# EAGLE board BE_PROJECT_PCB (EAGLE 9.5.2), part 1 of 2
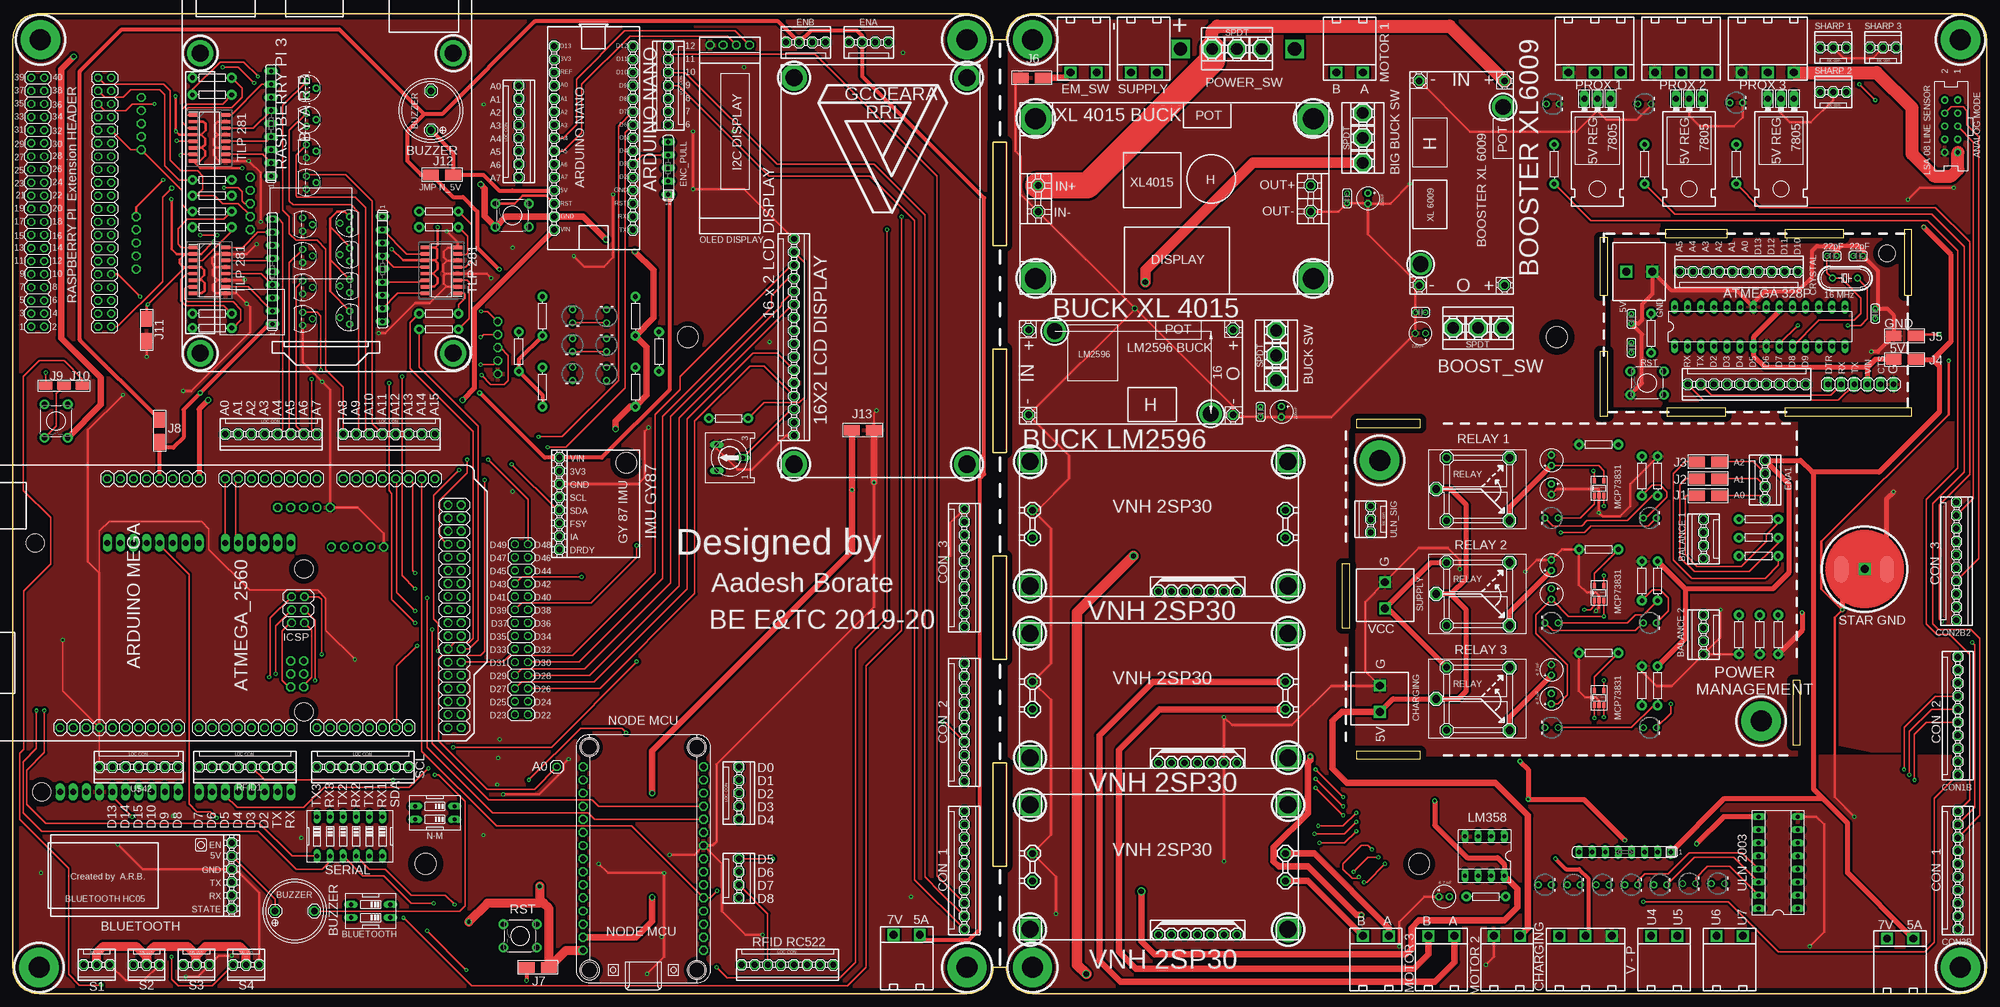
[diagram p3: board, top side]
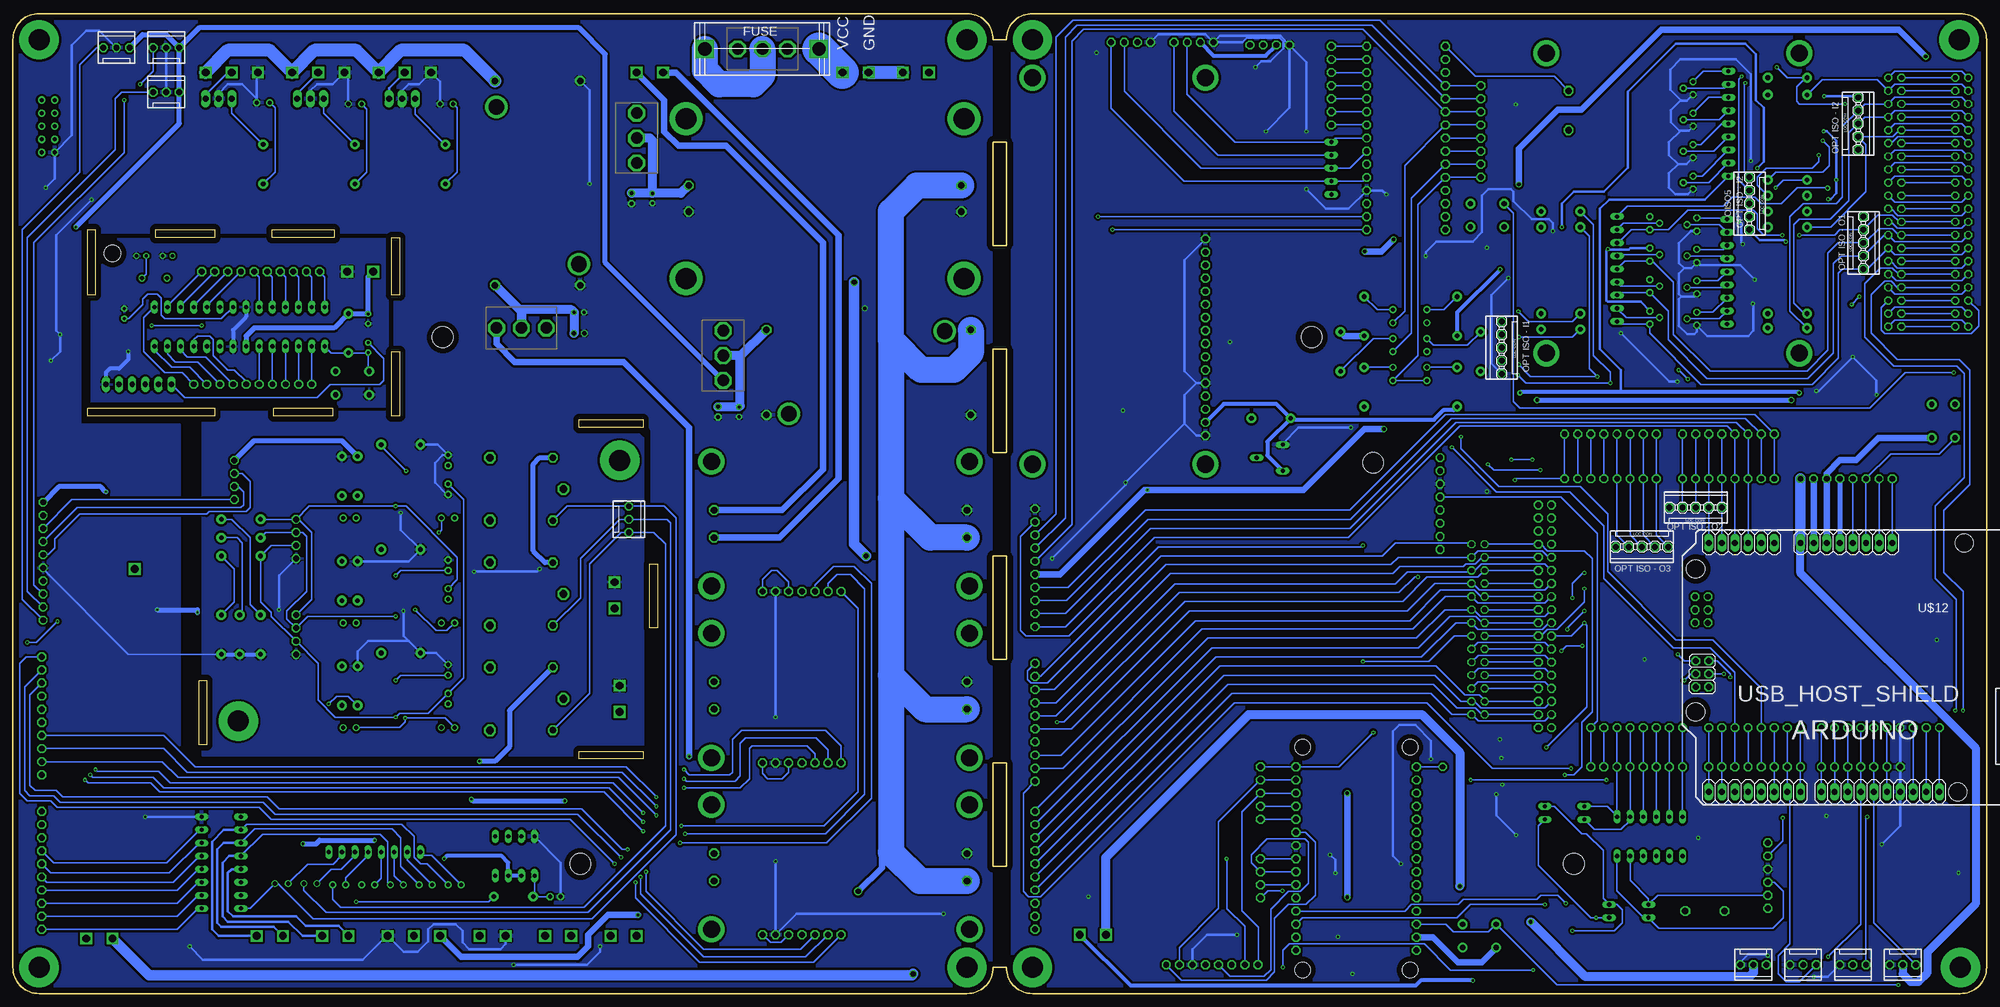
[diagram p4: board, bottom side, seen from below]

Size 382.52 x 189.99 mm. Coordinates in mm from the lower left corner, seen from the top.
Outline: 0,184.91 0,5.08 arc90 5.08,0 184.91,0 arc90 189.99,5.08 192.53,5.08 arc90 197.61,0 377.44,0 arc90 382.52,5.08 382.52,184.91 arc90 377.44,189.99 197.61,189.99 arc90 192.53,184.91 189.99,184.91 arc90 184.91,189.99 5.08,189.99 arc90 0,184.91
Outline: 189.99,165.1 189.99,145.03 192.53,145.03 192.53,165.1 189.99,165.1
Outline: 189.99,124.97 189.99,104.9 192.53,104.9 192.53,124.97 189.99,124.97
Outline: 189.99,84.84 189.99,64.77 192.53,64.77 192.53,84.84 189.99,84.84
Outline: 189.99,44.7 192.53,44.7 192.53,24.64 189.99,24.64 189.99,44.7
Outline: 307.59,146.56 307.59,135.38 309.12,135.38 309.12,146.56 307.59,146.56
Outline: 307.59,124.46 307.59,112.01 309.12,112.01 309.12,124.46 307.59,124.46
Outline: 320.55,113.54 320.55,112.01 331.98,112.01 331.98,113.54 320.55,113.54
Outline: 343.41,113.54 343.41,112.01 368.05,112.01 368.05,113.54 343.41,113.54
Outline: 366.52,148.08 366.52,135.38 368.05,135.38 368.05,148.08 366.52,148.08
Outline: 343.41,148.08 343.41,146.56 354.84,146.56 354.84,148.08 343.41,148.08
Outline: 320.29,146.56 332.23,146.56 332.23,148.08 320.29,148.08 320.29,146.56
Outline: 260.35,109.73 272.8,109.73 272.8,111.25 260.35,111.25 260.35,109.73
Outline: 257.56,83.31 257.56,70.87 259.08,70.87 259.08,83.31 257.56,83.31
Outline: 260.35,45.47 272.8,45.47 272.8,46.99 260.35,46.99 260.35,45.47
Outline: 344.93,60.71 344.93,48.26 346.46,48.26 346.46,60.71 344.93,60.71
Copper layers (1*16): Top 0.035mm / dielectric 1.5mm / Bottom 0.035mm
Design rules "default *": minimum track width 12mil, minimum drill 0.35mm, track to track 17mil, track to pad 12mil, pad to pad 12mil, via to via 12mil, smd to smd 12mil, copper to edge 40mil, drill to drill 40mil, minimum pad ring 10mil, minimum via ring 8mil, stop-mask expansion 12mil, vias tented up to drill 0mil, thermal gap 12mil
Net classes: 0 default: width 0.305 mm, drill 0.203 mm, clearance 0.203 mm; 1 V_SUPP: width 5.08 mm, drill 2.032 mm, clearance 0.406 mm; 2 GND: width 0.508 mm, drill 0.203 mm, clearance 0.305 mm; 5 5V: width 0.762 mm, drill 0.406 mm, clearance 0.305 mm; 6 7V: width 1.778 mm, drill 0.762 mm, clearance 0.305 mm
Holes 4.06 mm at 130.81,127.25 299.21,127.25 80.01,25.15 272.54,25.15
Holes 3.3 mm at 363.22,143.51
tRestrict: area 76.7,21.8 to 83.3,28.5; area 295.9,123.9 to 302.5,130.6

## Footprints (pad centres in the part's own frame; a part is rotated, then mirrored left to right if it is on the bottom)
SIL9 = drill 0.813 long: 1 -10.16,0; 2 -7.62,0; 3 -5.08,0; 4 -2.54,0; 5 0,0; 6 2.54,0; 7 5.08,0; 8 7.62,0; 9 10.16,0
AB_RIGHT_TER_BLK = drill 1.524 square: 1 -5.842,2.794; 2 -5.842,-2.286
AB_ARDUINO_MEGA = drill 1.13 octagon: 3V3 24.13,21.59; 5V 24.13,19.05; 5V1 -24.13,-36.83; 5V2 -24.13,-39.37; 5V3 -3.81,-9.017; - 24.13,29.21; A0 24.13,6.35; A1 24.13,3.81; A2 24.13,1.27; A3 24.13,-1.27; A4 24.13,-3.81; A5 24.13,-6.35; A6 24.13,-8.89; A7 24.13,-11.43; A8 24.13,-16.51; A9 24.13,-19.05; A10 24.13,-21.59; A11 24.13,-24.13; A12 24.13,-26.67; A13 24.13,-29.21; A14 24.13,-31.75; A15 24.13,-34.29; AREF -24.13,33.274; D2 -24.13,-1.27; D3 -24.13,1.27; D4 -24.13,3.81; D5 -24.13,6.35; D6 -24.13,8.89; D7 -24.13,11.43; D8 -24.13,15.494; D9 -24.13,18.034; D10 -24.13,20.574; D11 -24.13,23.114; D12 -24.13,25.654; D13 -24.13,28.194; D22 -21.59,-36.83; D23 -21.59,-39.37; D24 -19.05,-36.83; D25 -19.05,-39.37; D26 -16.51,-36.83; D27 -16.51,-39.37; D28 -13.97,-36.83; D29 -13.97,-39.37; D30 -11.43,-36.83; D31 -11.43,-39.37; D32 -8.89,-36.83; D33 -8.89,-39.37; D34 -6.35,-36.83; D35 -6.35,-39.37; D36 -3.81,-36.83; D37 -3.81,-39.37; D38 -1.27,-36.83; D39 -1.27,-39.37; D40 1.27,-36.83; D41 1.27,-39.37; D42 3.81,-36.83; D43 3.81,-39.37; D44 6.35,-36.83; D45 6.35,-39.37; D46 8.89,-36.83; D47 8.89,-39.37; D48 11.43,-36.83; D49 11.43,-39.37; D50 13.97,-36.83; D51 13.97,-39.37; D52 16.51,-36.83; D53 16.51,-39.37; GD3 19.05,-36.83; GD4 19.05,-39.37; GND 24.13,13.97; GND1 24.13,16.51; GND2 -24.13,30.734; GND5 1.245,-9.017; IOREF 24.13,26.67; MISO -3.81,-6.502; MOSI -1.295,-9.017; RST 24.13,24.13; RST1 1.245,-6.502; RX0 -24.13,-6.35; RX1 -24.13,-24.13; RX2 -24.13,-19.05; RX3 -24.13,-13.97; SCK -1.295,-6.502; SCL -24.13,-29.21; SCLU -24.13,38.354; SDA -24.13,-26.67; SDAU -24.13,35.814; TX0 -24.13,-3.81; TX1 -24.13,-21.59; TX2 -24.13,-16.51; TX3 -24.13,-11.43; VIN 24.13,11.43
AB_4PIN_LOC_CONNECTOR = drill 1.143 octagon: 1 0,-3.81; 2 0,-1.27; 3 0,1.27; 4 0,3.81
AB_SCREW_TERMINAL_5MM_2PIN = drill 1.524 square: 1 0,2.54; 2 0,-2.54
TO92 = drill 0.813 octagon: 1 1.27,0; 2 0,1.905; 3 -1.27,0
EDG-02 = drill 0.813 long: 1 -1.27,-3.81; 2 1.27,-3.81; 3 1.27,3.81; 4 -1.27,3.81
C020-035X018 = drill 0.61 pad 1.016 octagon: 1 -0.953,0; 2 0.953,0
AB_JOINT_GND = smd 2.54 x 5.08: 1 4.318,0; 2 -4.572,0 | drill 1.524 square: 3 0,0
LED_3MM-NS = drill 0.813: A -1.27,0; K 1.27,0
AXIAL-0.3 = drill 0.9 pad 1.88: P$1 -3.81,0; P$2 3.81,0
AB_10PIN_LOC_CONNECTOR = drill 1.143 octagon: 1 0,-12.7; 2 0,-10.16; 3 0,-7.62; 4 0,-5.08; 5 0,-2.54; 6 0,0; 7 0,2.54; 8 0,5.08; 9 0,7.62; 10 0,10.16
SIL5 = drill 0.813 long: 1 -5.08,0; 2 -2.54,0; 3 0,0; 4 2.54,0; 5 5.08,0
AB_FUSE_HOLDER = drill 2.54 square: IN 0,11.176; OUT 0,-10.922
RS3 = drill 0.813 long: A -2.54,2.54; E 2.54,2.54; S 0,-2.54
SOCKET-16 = drill 0.813 long: 1 -8.89,-3.81; 2 -6.35,-3.81; 3 -3.81,-3.81; 4 -1.27,-3.81; 5 1.27,-3.81; 6 3.81,-3.81; 7 6.35,-3.81; 8 8.89,-3.81; 9 8.89,3.81; 10 6.35,3.81; 11 3.81,3.81; 12 1.27,3.81; 13 -1.27,3.81; 14 -3.81,3.81; 15 -6.35,3.81; 16 -8.89,3.81
SOCKET-08 = drill 0.813 long: 1 -3.81,-3.81; 2 -1.27,-3.81; 3 1.27,-3.81; 4 3.81,-3.81; 5 3.81,3.81; 6 1.27,3.81; 7 -1.27,3.81; 8 -3.81,3.81
DIL28-3 = drill 0.813 long: 1 -16.51,-3.81; 2 -13.97,-3.81; 3 -11.43,-3.81; 4 -8.89,-3.81; 5 -6.35,-3.81; 6 -3.81,-3.81; 7 -1.27,-3.81; 8 1.27,-3.81; 9 3.81,-3.81; 10 6.35,-3.81; 11 8.89,-3.81; 12 11.43,-3.81; 13 13.97,-3.81; 14 16.51,-3.81; 15 16.51,3.81; 16 13.97,3.81; 17 11.43,3.81; 18 8.89,3.81; 19 6.35,3.81; 20 3.81,3.81; 21 1.27,3.81; 22 -1.27,3.81; 23 -3.81,3.81; 24 -6.35,3.81; 25 -8.89,3.81; 26 -11.43,3.81; 27 -13.97,3.81; 28 -16.51,3.81
SOIC127P700X210-16N = smd 1.8 x 0.65: 1 -3.15,4.445; 2 -3.15,3.175; 3 -3.15,1.905; 4 -3.15,0.635; 5 -3.15,-0.635; 6 -3.15,-1.905; 7 -3.15,-3.175; 8 -3.15,-4.445; 9 3.15,-4.445; 10 3.15,-3.175; 11 3.15,-1.905; 12 3.15,-0.635; 13 3.15,0.635; 14 3.15,1.905; 15 3.15,3.175; 16 3.15,4.445
1X01 = drill 1.016 octagon: 1 0,0
2X14 = drill 1.016 octagon: 1 -16.51,-1.27; 2 -16.51,1.27; 3 -13.97,-1.27; 4 -13.97,1.27; 5 -11.43,-1.27; 6 -11.43,1.27; 7 -8.89,-1.27; 8 -8.89,1.27; 9 -6.35,-1.27; 10 -6.35,1.27; 11 -3.81,-1.27; 12 -3.81,1.27; 13 -1.27,-1.27; 14 -1.27,1.27; 15 1.27,-1.27; 16 1.27,1.27; 17 3.81,-1.27; 18 3.81,1.27; 19 6.35,-1.27; 20 6.35,1.27; 21 8.89,-1.27; 22 8.89,1.27; 23 11.43,-1.27; 24 11.43,1.27; 25 13.97,-1.27; 26 13.97,1.27; 27 16.51,-1.27; 28 16.51,1.27
1X06 = drill 1.016 long: 1 -6.35,0; 2 -3.81,0; 3 -1.27,0; 4 1.27,0; 5 3.81,0; 6 6.35,0
S10V = drill 0.8 pad 1.4: 1 5.08,-1.27; 2 5.08,1.27; 3 2.54,-1.27; 4 2.54,1.27; 5 0,-1.27; 6 0,1.27; 7 -2.54,-1.27; 8 -2.54,1.27; 9 -5.08,-1.27; 10 -5.08,1.27
TACTILE_SWITCH_PTH_6.0MM = drill 1.016 pad 1.88: 1 -3.251,2.261; 2 3.251,2.261; 3 -3.251,-2.261; 4 3.251,-2.261
AB_JUMPER_ONE_WAY = smd 3.048 x 2.032: 1 -2.286,0; 2 2.032,0
AB_5PIN_LOC_CONNECTOR = drill 1.143 octagon: 1 -1.524,-5.08; 2 -1.524,-2.54; 3 -1.524,0; 4 -1.524,2.54; 5 -1.524,5.08
AB_RIGHT_TER_BLK_3PIN = drill 1.524 square: 1 -5.588,5.08; 2 -5.588,0; 3 -5.588,-5.08
HC49U-V = drill 0.813: 1 -2.413,0; 2 2.413,0
2X20 = drill 1.016 octagon: 1 -24.13,-1.27; 2 -24.13,1.27; 3 -21.59,-1.27; 4 -21.59,1.27; 5 -19.05,-1.27; 6 -19.05,1.27; 7 -16.51,-1.27; 8 -16.51,1.27; 9 -13.97,-1.27; 10 -13.97,1.27; 11 -11.43,-1.27; 12 -11.43,1.27; 13 -8.89,-1.27; 14 -8.89,1.27; 15 -6.35,-1.27; 16 -6.35,1.27; 17 -3.81,-1.27; 18 -3.81,1.27; 19 -1.27,-1.27; 20 -1.27,1.27; 21 1.27,-1.27; 22 1.27,1.27; 23 3.81,-1.27; 24 3.81,1.27; 25 6.35,-1.27; 26 6.35,1.27; 27 8.89,-1.27; 28 8.89,1.27; 29 11.43,-1.27; 30 11.43,1.27; 31 13.97,-1.27; 32 13.97,1.27; 33 16.51,-1.27; 34 16.51,1.27; 35 19.05,-1.27; 36 19.05,1.27; 37 21.59,-1.27; 38 21.59,1.27; 39 24.13,-1.27; 40 24.13,1.27
AB_ELECTROMAGNETIC_RELAY = drill 1.27 octagon: + -7.366,6.096; - -7.366,-6.096 | drill 1.524 octagon: COM -9.398,0; OUT_1 4.826,-6.096; OUT_2 4.826,6.096
AB_8PIN_LOC_CONNECTOR = drill 1.143 octagon: 1 -1.27,-8.89; 2 -1.27,-6.35; 3 -1.27,-3.81; 4 -1.27,-1.27; 5 -1.27,1.27; 6 -1.27,3.81; 7 -1.27,6.35; 8 -1.27,8.89
SIL8 = drill 0.813 long: 1 -8.89,0; 2 -6.35,0; 3 -3.81,0; 4 -1.27,0; 5 1.27,0; 6 3.81,0; 7 6.35,0; 8 8.89,0
AB_3PIN_LOC_CONNECTOR = drill 1.143 octagon: 1 -1.524,-2.54; 2 -1.524,0; 3 -1.524,2.54
EDG-06 = drill 0.813 long: 1 -6.35,-3.81; 2 -3.81,-3.81; 3 -1.27,-3.81; 4 1.27,-3.81; 5 3.81,-3.81; 6 6.35,-3.81; 7 6.35,3.81; 8 3.81,3.81; 9 1.27,3.81; 10 -1.27,3.81; 11 -3.81,3.81; 12 -6.35,3.81
AB_16X2_LCD_DISPLAY = drill 1.143 octagon: D0 0.508,7.874; D1 3.048,7.874; D2 5.588,7.874; D3 8.128,7.874; D4 10.668,7.874; D5 13.208,7.874; D6 15.748,7.874; D7 18.288,7.874; EN -2.032,7.874; GND -14.732,7.874; L+ 20.828,7.874; L- 23.368,7.874; R/W -4.572,7.874; RS -7.112,7.874; VCON -9.652,7.874; VIN -12.192,7.874 | drill 3.302 pad 5.08: P$1 -20.32,7.874; P$2 -20.32,-25.654; P$3 54.61,-25.654; P$4 54.61,7.874
AB_VNH2SP30_MODULE = drill 1.168 octagon: 5V 16.002,-13.208; CS 8.382,-13.208; EN 10.922,-13.208; GND 13.462,-13.208; INA 5.842,-13.208; INB 3.302,-13.208; PWM 0.762,-13.208 | drill 1.27 octagon: IN+ -23.622,-2.794; IN- -23.622,2.54; OA 25.4,2.54; OB 25.4,-2.794 | drill 3.302 pad 5.08: P$1 -24.13,11.938; P$2 -24.13,-12.192; P$3 25.908,-12.192; P$4 25.908,11.938
AB_ESP8266_BREAKOUT = drill 1.143 octagon: 3V3 -11.43,-4.572; 3V31 -11.43,18.288; 3V32 11.938,8.128; A0 11.938,-17.272; CLK 11.938,3.048; CMD 11.938,-2.032; D0 -11.43,-17.272; D1 -11.43,-14.732; D2 -11.43,-12.192; D3 -11.43,-9.652; D4 -11.43,-7.112; D5 -11.43,0.508; D6 -11.43,3.048; D7 -11.43,5.588; D8 -11.43,8.128; EN 11.938,10.668; GND 11.938,5.588; GND1 -11.43,15.748; GND2 -11.43,-2.032; GND3 11.938,15.748; RST 11.938,13.208; RSV 11.938,-12.192; RSV1 11.938,-14.732; RX -11.43,10.668; SD1 11.938,-4.572; SD2 11.938,-7.112; SD3 11.938,-9.652; SDD 11.938,0.508; TX -11.43,13.208; VIN 11.938,18.288 | hole 3.048: -10.16,-21.082; 10.668,-21.082; -10.16,22.098; 10.668,22.098
AB_RASPBERRY_PI_3 = drill 3.302 pad 5.08: P$1 -39.624,27.94; P$2 -39.624,-21.082; P$3 18.542,-21.082; P$4 18.542,27.94
AB_LM2596_BUCK_CONVERTER = drill 1.27 octagon: IN+ -19.304,6.35; IN- -19.304,-10.16; OUT+ 20.32,6.35; OUT- 20.32,-10.16 | drill 3.048 pad 4.318: P$1 -14.224,6.096; P$2 16.002,-9.906
AB_XL6009E1_BOOST_CONVERTER = drill 1.27 octagon: IN+ -19.304,6.35; IN- -19.304,-10.16; OUT+ 20.32,6.35; OUT- 20.32,-10.16 | drill 3.048 pad 4.318: P$1 -14.224,6.096; P$2 16.256,-9.906
AB_IMU_GY87 = drill 1.143 octagon: 3V3 -6.35,-7.112; DRDY 8.89,-7.112; FSY 3.81,-7.112; GND -3.81,-7.112; IA 6.35,-7.112; SCL -1.27,-7.112; SDA 1.27,-7.112; VIN -8.89,-7.112 | hole 4: -7.874,5.842
AB_BLUETOOTH_HC05 = drill 1.143 octagon: 5V -9.906,-4.064; EN -9.906,-6.604; GND -9.906,-1.524; RX -9.906,3.556; ST -9.906,6.096; TX -9.906,1.016
AB_USB_HOST_SHIELD_ARDUINO = drill 1.143 long: 3V3 1.27,-24.13; 5V1 3.81,-24.13; - -6.35,-24.13; A0 16.51,-24.13; A1 19.05,-24.13; A2 21.59,-24.13; A3 24.13,-24.13; A4 26.67,-24.13; A5 29.21,-24.13; AREF -10.414,24.13; D2 24.13,24.13; D3 21.59,24.13; D4 19.05,24.13; D5 16.51,24.13; D6 13.97,24.13; D7 11.43,24.13; D8 7.366,24.13; D9 4.826,24.13; D10 2.286,24.13; D11 -0.254,24.13; D12 -2.794,24.13; D13 -5.334,24.13; GND -7.874,24.13; GND2 8.89,-24.13; GND3 6.35,-24.13; RST1 -1.27,-24.13; RX0 29.21,24.13; SCL -15.494,24.13; SDA -12.954,24.13; TX0 26.67,24.13; VIN 11.43,-24.13; VREF -3.81,-24.13 | drill 1.168 octagon: 5V 31.75,3.81; GND1 31.75,-1.27; MISO 29.21,3.81; MOSI 31.75,1.27; RST 29.21,-1.27; SCK 29.21,1.27 | hole 3.56: 31.75,-19.05; 31.75,8.636; -19.05,24.13; -20.32,-24.13
AB_XL_4015_5A_BUCK = drill 1.27 octagon: IN+ -21.844,-3.302; IN- -21.844,-8.382; OUT+ 30.988,-3.302; OUT- 30.988,-8.382 | drill 4.064 pad 6.452: P$1 -22.352,9.652; P$2 -22.352,-21.336; P$3 31.496,-21.336; P$4 31.496,9.652
AB_SW = drill 2.25 octagon: IP 0,3.048; O1 -4.826,3.048; O2 4.826,3.048
AB_MCP_73831_LIPO_CHARGER = smd 0.599 x 1.1: PROG -0.864,1.346; STAT -0.864,-1.499; VBAT 1.016,-1.499; VDD 1.016,1.346; VSS 0.076,-1.499
AB_POL_CAP = drill 0.813 octagon: 1 -1.016,0; 2 1.016,0
AB_0.91INCH_I2C_DISPLAY = drill 1.143 octagon: GND -16.002,-3.302; SCL -16.002,1.778; SDA -16.002,4.318; VCC -16.002,-0.762
AB_BUZZER = drill 1.27 octagon: + -3.81,0; - 3.81,0
AB_JUMPER_TWO_WAY = smd 2.54 x 1.524: 1 -3.556,0; 2 3.556,0; C 0,0
AB_ARDUINO_NANO = drill 1.13 octagon: 3V3 -7.62,15.24; 5V -7.62,-10.16; A0 -7.62,10.16; A1 -7.62,7.62; A2 -7.62,5.08; A3 -7.62,2.54; A4 -7.62,0; A5 -7.62,-2.54; A6 -7.62,-5.08; A7 -7.62,-7.62; D2 7.62,-7.62; D3 7.62,-5.08; D4 7.62,-2.54; D5 7.62,0; D6 7.62,2.54; D7 7.62,5.08; D8 7.62,7.62; D9 7.62,10.16; D10 7.62,12.7; D11 7.62,15.24; D12 7.62,17.78; D13 -7.62,17.78; GND -7.62,-15.24; GND1 7.62,-10.16; REF -7.62,12.7; RST -7.62,-12.7; RST1 7.62,-12.7; RX 7.62,-15.24; TX 7.62,-17.78; VIN -7.62,-17.78
AB_7PIN_LOC_CONNECTOR = drill 1.143 octagon: 1 -1.524,-7.62; 2 -1.524,-5.08; 3 -1.524,-2.54; 4 -1.524,0; 5 -1.524,2.54; 6 -1.524,5.08; 7 -1.524,7.62
AB_7805_FLAT = drill 1.143 long: 1 -7.874,1.778; 2 -7.874,-0.762; 3 -7.874,-3.302
AB_PLATED_DRILL_160MIL = drill 4.064 pad 7.62: 1 0,0

## Placement (x,y rotation side)
10K  10k  [SIL9]  71.63,140.46 270 top
A  AB_RIGHT_TER_BLK  [AB_RIGHT_TER_BLK]  172.97,5.59 270 top
ATMEGA_2560  AB_ARDUINO_MEGA  [AB_ARDUINO_MEGA]  47.5,75.69 90 top
B  AB_RIGHT_TER_BLK  [AB_RIGHT_TER_BLK]  365.51,4.83 270 top
BALANCE  AB_4PIN_LOC_CONNECTOR  [AB_4PIN_LOC_CONNECTOR]  327.66,88.14 0 top
BALANCE1  AB_4PIN_LOC_CONNECTOR  [AB_4PIN_LOC_CONNECTOR]  327.66,69.6 0 top
BAT1  AB_SCREW_TERMINAL_5MM_2PIN  [AB_SCREW_TERMINAL_5MM_2PIN]  265.94,77.22 180 top
BAT6  AB_SCREW_TERMINAL_5MM_2PIN  [AB_SCREW_TERMINAL_5MM_2PIN]  315.21,139.95 90 top
BAT_SUPP  AB_RIGHT_TER_BLK  [AB_RIGHT_TER_BLK]  219.46,184.4 90 top
BC547  BC547  [TO92]  65.28,131.06 90 top
BLUETOOTH  [EDG-02]  69.34,16 90 top
C1  100nF  [C020-035X018]  241.81,112.78 90 top
C2  100nF  [C020-035X018]  313.69,125.22 270 top
C3  100nF  [C020-035X018]  272.8,132.08 0 top
C4  100nF  [C020-035X018]  258.57,154.18 90 top
C5  100nF  [C020-035X018]  313.69,130.81 270 top
C6  100nF  [C020-035X018]  357.63,143 180 top
C7  100nF  [C020-035X018]  352.55,143 180 top
C8  100nF  [C020-035X018]  360.93,131.83 90 top
C_GND  AB_JOINT_GND  [AB_JOINT_GND]  358.9,82.3 0 top
CEL1CC  [LED_3MM-NS]  298.2,92.2 180 top
CEL1CO  [LED_3MM-NS]  317.25,92.2 0 top
CEL1RC  470  [AXIAL-0.3]  318.77,100.33 270 top
CEL1RO  470  [AXIAL-0.3]  315.72,100.33 270 top
CEL2CC  [LED_3MM-NS]  317.25,71.88 0 top
CEL2CO  [LED_3MM-NS]  298.2,71.88 180 top
CEL2RC  470  [AXIAL-0.3]  315.72,80.01 270 top
CEL2RO  470  [AXIAL-0.3]  318.77,80.01 270 top
CEL2RO1  470  [AXIAL-0.3]  317.5,128.02 90 top
CEL3CC  [LED_3MM-NS]  317.25,51.56 0 top
CEL3CO  [LED_3MM-NS]  298.2,51.56 180 top
CEL3RC  470  [AXIAL-0.3]  315.72,59.69 270 top
CEL3RO  470  [AXIAL-0.3]  318.77,59.69 270 top
CON1A  AB_10PIN_LOC_CONNECTOR  [AB_10PIN_LOC_CONNECTOR]  184.4,51.31 180 top
CON1B  AB_10PIN_LOC_CONNECTOR  [AB_10PIN_LOC_CONNECTOR]  376.94,52.58 180 top
CON2A  AB_10PIN_LOC_CONNECTOR  [AB_10PIN_LOC_CONNECTOR]  184.4,22.61 180 top
CON2B  AB_10PIN_LOC_CONNECTOR  [AB_10PIN_LOC_CONNECTOR]  376.94,22.61 180 top
CON2B1  AB_10PIN_LOC_CONNECTOR  [AB_10PIN_LOC_CONNECTOR]  184.4,81.28 180 top
CON2B2  AB_10PIN_LOC_CONNECTOR  [AB_10PIN_LOC_CONNECTOR]  376.68,82.55 180 top
CS  AB_RIGHT_TER_BLK  [AB_RIGHT_TER_BLK]  289.31,5.33 270 top
D1  [LED_3MM-NS]  316.23,172.47 0 top
D2  [LED_3MM-NS]  334.01,172.72 0 top
D3  [LED_3MM-NS]  298.45,172.47 0 top
EM_SW  AB_RIGHT_TER_BLK  [AB_RIGHT_TER_BLK]  207.77,184.4 90 top
ENA  AB_4PIN_LOC_CONNECTOR  [AB_4PIN_LOC_CONNECTOR]  165.86,184.4 270 top
ENA1  AB_4PIN_LOC_CONNECTOR  [AB_4PIN_LOC_CONNECTOR]  339.6,99.57 180 top
ENB  AB_4PIN_LOC_CONNECTOR  [AB_4PIN_LOC_CONNECTOR]  153.67,184.4 270 top
ENC_PULL  [SIL5]  127,160.02 90 top
FUSE  AB_FUSE_HOLDER  [AB_FUSE_HOLDER]  237.49,183.13 270 bottom
G_P2  [RS3]  138.94,103.89 90 top
IC1  [SOCKET-16]  342.14,25.4 90 top
IC2  [SOCKET-08]  285.24,26.67 180 top
IC3  [DIL28-3]  338.58,129.29 0 top
IC8  TLP281-4(GB,J,F)  [SOIC127P700X210-16N]  83.06,140.21 180 top
IC9  TLP281-4(GB,J,F)  [SOIC127P700X210-16N]  38.1,140.21 0 top
IC10  TLP281-4(GB,J,F)  [SOIC127P700X210-16N]  38.1,165.86 0 top
IH1  [LED_3MM-NS]  108.46,120.14 270 top
IH2  [LED_3MM-NS]  108.46,125.73 270 top
IH3  [LED_3MM-NS]  108.46,131.32 270 top
IL1  [LED_3MM-NS]  115.06,120.14 90 top
IL2  [LED_3MM-NS]  115.06,125.73 90 top
IL3  [LED_3MM-NS]  115.06,131.32 90 top
IRH1  470  [AXIAL-0.3]  102.62,117.6 90 top
IRH2  470  [AXIAL-0.3]  98.04,124.46 90 top
IRH3  470  [AXIAL-0.3]  102.62,131.32 90 top
IRL1  470  [AXIAL-0.3]  120.65,117.6 90 top
IRL2  470  [AXIAL-0.3]  125.22,124.46 270 top
IRL3  470  [AXIAL-0.3]  120.65,131.32 90 top
JP1  [1X01]  105.41,43.94 0 top
JP2  [2X14]  98.55,70.61 90 top
JP3  [1X06]  358.14,118.11 0 top
L1  [LED_3MM-NS]  330.45,21.34 0 top
L2  [LED_3MM-NS]  324.87,21.34 0 top
L3  [LED_3MM-NS]  319.28,21.08 0 top
L4  [LED_3MM-NS]  313.69,21.08 0 top
L5  [LED_3MM-NS]  308.1,21.08 0 top
L6  [LED_3MM-NS]  302.51,21.08 0 top
L7  [LED_3MM-NS]  296.93,21.08 0 top
LSA_2  LSA1  [S10V]  375.67,168.15 90 top
M1  AB_RIGHT_TER_BLK  [AB_RIGHT_TER_BLK]  259.33,184.4 90 top
M2  AB_RIGHT_TER_BLK  [AB_RIGHT_TER_BLK]  276.61,5.33 270 top
M3  AB_RIGHT_TER_BLK  [AB_RIGHT_TER_BLK]  263.91,5.33 270 top
M_RST  MOMENTARY-SWITCH-SPST-PTH-6.0MM  [TACTILE_SWITCH_PTH_6.0MM]  98.3,11.18 0 top
MEGA_RST  MOMENTARY-SWITCH-SPST-PTH-6.0MM  [TACTILE_SWITCH_PTH_6.0MM]  8.38,111 90 top
MEGA_RST1  MOMENTARY-SWITCH-SPST-PTH-6.0MM  [TACTILE_SWITCH_PTH_6.0MM]  316.74,118.36 0 top
N-M  [EDG-02]  81.79,35.05 90 top
N_RST  MOMENTARY-SWITCH-SPST-PTH-6.0MM  [TACTILE_SWITCH_PTH_6.0MM]  96.77,150.88 0 top
NANO  AB_JUMPER_ONE_WAY  [AB_JUMPER_ONE_WAY]  83.31,158.75 0 top
NODEMCU  AB_JUMPER_ONE_WAY  [AB_JUMPER_ONE_WAY]  101.6,5.08 180 top
OISO1  AB_5PIN_LOC_CONNECTOR  [AB_5PIN_LOC_CONNECTOR]  92.46,125.22 0 bottom
OISO2  AB_5PIN_LOC_CONNECTOR  [AB_5PIN_LOC_CONNECTOR]  25.4,145.54 180 bottom
OISO3  AB_5PIN_LOC_CONNECTOR  [AB_5PIN_LOC_CONNECTOR]  26.42,168.66 180 bottom
OISO4  AB_5PIN_LOC_CONNECTOR  [AB_5PIN_LOC_CONNECTOR]  56.39,92.71 270 bottom
OISO5  AB_5PIN_LOC_CONNECTOR  [AB_5PIN_LOC_CONNECTOR]  44.45,153.16 0 bottom
OISO6  AB_5PIN_LOC_CONNECTOR  [AB_5PIN_LOC_CONNECTOR]  66.8,88.14 90 bottom
PPR_R1  3.9k  [AXIAL-0.3]  285.5,18.8 0 top
PROX1  AB_RIGHT_TER_BLK_3PIN  [AB_RIGHT_TER_BLK_3PIN]  323.34,184.15 90 top
PROX2  AB_RIGHT_TER_BLK_3PIN  [AB_RIGHT_TER_BLK_3PIN]  340.11,184.15 90 top
PROX3  AB_RIGHT_TER_BLK_3PIN  [AB_RIGHT_TER_BLK_3PIN]  306.58,184.15 90 top
Q3  [HC49U-V]  355.09,138.68 0 top
R4  4.7k  [AXIAL-0.3]  316.23,160.78 270 top
R5  2k  [AXIAL-0.3]  307.34,66.04 0 top
R6  2k  [AXIAL-0.3]  307.34,86.11 0 top
R7  2k  [AXIAL-0.3]  307.34,106.43 0 top
R10  4.7k  [AXIAL-0.3]  334.01,160.78 270 top
R11  4.7k  [AXIAL-0.3]  298.7,160.78 270 top
R17  470  [AXIAL-0.3]  138.68,111.51 0 top
R18  220  [AXIAL-0.3]  82.55,128.78 180 top
R19  220  [AXIAL-0.3]  82.55,151.64 180 top
R20  220  [AXIAL-0.3]  82.55,148.59 180 top
R21  220  [AXIAL-0.3]  38.61,151.64 180 top
R22  220  [AXIAL-0.3]  38.61,148.59 180 top
R23  220  [AXIAL-0.3]  38.61,131.83 180 top
R24  220  [AXIAL-0.3]  38.61,129.03 180 top
R25  220  [AXIAL-0.3]  38.61,177.55 180 top
R26  220  [AXIAL-0.3]  38.61,174.24 180 top
R27  220  [AXIAL-0.3]  38.61,157.73 180 top
R28  220  [AXIAL-0.3]  38.61,154.69 180 top
R32  220  [AXIAL-0.3]  82.55,131.83 180 top
R33  470  [AXIAL-0.3]  338.33,91.95 0 top
R34  470  [AXIAL-0.3]  334.52,69.6 90 top
R35  470  [AXIAL-0.3]  338.33,88.39 0 top
R36  470  [AXIAL-0.3]  338.58,69.6 90 top
R37  470  [AXIAL-0.3]  338.33,84.84 0 top
R38  470  [AXIAL-0.3]  342.14,69.6 90 top
RASPI_PORT1  [2X20]  17.78,153.42 90 top
RASPI_PORT2  [2X20]  4.83,153.42 270 top
REL1  12v  [AB_ELECTROMAGNETIC_RELAY]  285.24,97.79 0 top
REL2  12v  [AB_ELECTROMAGNETIC_RELAY]  285.24,77.47 0 top
REL3  12v  [AB_ELECTROMAGNETIC_RELAY]  285.24,57.15 0 top
RFID  AB_8PIN_LOC_CONNECTOR  [AB_8PIN_LOC_CONNECTOR]  150.11,6.86 90 top
RFID1  AB_8PIN_LOC_CONNECTOR  [AB_8PIN_LOC_CONNECTOR]  44.96,45.21 90 top
RFID2  AB_8PIN_LOC_CONNECTOR  [AB_8PIN_LOC_CONNECTOR]  67.82,45.21 90 top
RFID3  AB_8PIN_LOC_CONNECTOR  [AB_8PIN_LOC_CONNECTOR]  50.04,109.73 90 top
RFID4  AB_8PIN_LOC_CONNECTOR  [AB_8PIN_LOC_CONNECTOR]  72.9,109.73 90 top
RN1  [SIL8]  312.42,27.43 180 top
RN6  [SIL9]  50.29,139.95 90 top
RN7  [SIL9]  50.04,168.66 90 top
SERVO1  AB_3PIN_LOC_CONNECTOR  [AB_3PIN_LOC_CONNECTOR]  35.56,7.11 90 top
SERVO2  AB_3PIN_LOC_CONNECTOR  [AB_3PIN_LOC_CONNECTOR]  16.26,7.11 90 top
SERVO3  AB_3PIN_LOC_CONNECTOR  [AB_3PIN_LOC_CONNECTOR]  45.21,7.11 90 top
SERVO4  AB_3PIN_LOC_CONNECTOR  [AB_3PIN_LOC_CONNECTOR]  25.91,7.11 90 top
SHARP1  AB_3PIN_LOC_CONNECTOR  [AB_3PIN_LOC_CONNECTOR]  352.81,181.86 270 top
SHARP2  AB_3PIN_LOC_CONNECTOR  [AB_3PIN_LOC_CONNECTOR]  352.81,173.23 270 top
SHARP3  AB_3PIN_LOC_CONNECTOR  [AB_3PIN_LOC_CONNECTOR]  362.46,181.86 270 top
SW1  [EDG-06]  65.28,30.48 180 top
TR14  BC547  [TO92]  65.28,137.16 90 top
TR15  BC547  [TO92]  65.28,143.26 90 top
TR16  BC547  [TO92]  65.28,149.35 90 top
TR17  BC547  [TO92]  56.13,149.1 270 top
TR18  BC547  [TO92]  56.13,143 270 top
TR19  BC547  [TO92]  56.13,136.91 270 top
TR20  BC547  [TO92]  56.13,130.81 270 top
TR21  BC547  [TO92]  56.9,175.51 270 top
TR22  BC547  [TO92]  56.9,169.42 270 top
TR23  BC547  [TO92]  56.9,163.32 270 top
TR24  BC547  [TO92]  56.9,157.23 270 top
U45  AB_RIGHT_TER_BLK  [AB_RIGHT_TER_BLK]  319.79,5.33 270 top
U67  AB_RIGHT_TER_BLK  [AB_RIGHT_TER_BLK]  332.49,5.33 270 top
U$1  AB_JUMPER_ONE_WAY  [AB_JUMPER_ONE_WAY]  328.68,96.52 0 top
U$2  AB_16X2_LCD_DISPLAY  [AB_16X2_LCD_DISPLAY]  159.26,122.94 90 top
U$3  AB_VNH2SP30  [AB_VNH2SP30_MODULE]  221.23,91.19 0 top
U$4  ESP8266_NODEMCU_BY_AB  [AB_ESP8266_BREAKOUT]  122.43,26.67 180 top
U$5  AB_RASPBERRY_PI_3  [AB_RASPBERRY_PI_3]  64.26,163.75 90 top
U$6  AB_VNH2SP30  [AB_VNH2SP30_MODULE]  221.23,57.91 0 top
U$7  AB_LM2596_BUCK_CONVERTER  [AB_LM2596_BUCK_CONVERTER]  216.15,122.33 0 top
U$8  AB_XL6009_BOOST_CONVERTER  [AB_XL6009E1_BOOST_CONVERTER]  282.73,157.66 270 top
U$9  AB_VNH2SP30  [AB_VNH2SP30_MODULE]  221.23,24.64 0 top
U$10  AB_GY87  [AB_IMU_GY87]  113.03,95 270 top
U$11  AB_BLUETOOTH_HC05  [AB_BLUETOOTH_HC05]  32.51,22.61 180 top
U$12  AB_USB_HOST_SHIELD_ARDUINO  [AB_USB_HOST_SHIELD_ARDUINO]  24.64,63.25 180 bottom
U$13  AB_XL4015_5A_  [AB_XL_4015_5A_BUCK]  220.55,159.97 0 top
U$14  AB_SW  [AB_SW]  247.9,123.7 90 top
U$15  AB_SW  [AB_SW]  283.97,132.08 180 top
U$16  AB_SW  [AB_SW]  264.67,165.86 90 top
U$17  AB_JUMPER_ONE_WAY  [AB_JUMPER_ONE_WAY]  25.91,128.78 90 top
U$18  AB_MCP_73831_LIPO_CHARGER  [AB_MCP_73831_LIPO_CHARGER]  307.34,98.04 0 top
U$19  AB_MCP_73831_LIPO_CHARGER  [AB_MCP_73831_LIPO_CHARGER]  307.34,77.72 0 top
U$20  AB_MCP_73831_LIPO_CHARGER  [AB_MCP_73831_LIPO_CHARGER]  307.34,57.4 0 top
U$21  4.7 uF  [AB_POL_CAP]  298.2,77.47 90 top
U$22  4.7 uF  [AB_POL_CAP]  298.2,57.15 270 top
U$23  4.7 uF  [AB_POL_CAP]  298.2,97.79 90 top
U$24  AB_0.91_INCH_I2C_DISPLAY  [AB_0.91INCH_I2C_DISPLAY]  138.43,167.89 270 top
U$25  4.7 uF  [AB_POL_CAP]  298.2,103.38 270 top
U$26  4.7 uF  [AB_POL_CAP]  298.2,83.06 270 top
U$27  4.7 uF  [AB_POL_CAP]  298.2,62.74 270 top
U$28  AB_BUZZER  [AB_BUZZER]  81.03,171.2 90 top
U$29  4.7 uF  [AB_POL_CAP]  277.37,18.8 180 top
U$30  AB_JUMPER_TWO_WAY  [AB_JUMPER_TWO_WAY]  9.91,117.86 180 top
U$31  AB_JUMPER_ONE_WAY  [AB_JUMPER_ONE_WAY]  28.45,109.22 90 top
U$32  AB_SW  [AB_SW]  237.24,180.09 0 top
U$33  AB_JUMPER_ONE_WAY  [AB_JUMPER_ONE_WAY]  197.36,177.55 180 top
U$34  220uF  [AB_POL_CAP]  245.87,112.78 90 top
U$35  AB_ARDUINO_NANO  [AB_ARDUINO_NANO]  112.52,165.86 0 top
U$36  AB_SCREW_TERMINAL_5MM_2PIN  [AB_SCREW_TERMINAL_5MM_2PIN]  264.92,57.15 180 top
U$37  220uF  [AB_POL_CAP]  272.8,128.02 0 top
U$38  220uF  [AB_POL_CAP]  262.64,154.18 90 top
U$39  AB_BUZZER  [AB_BUZZER]  54.61,16 0 top
U$40  AB_JUMPER_ONE_WAY  [AB_JUMPER_ONE_WAY]  328.68,99.82 0 top
U$41  AB_JUMPER_ONE_WAY  [AB_JUMPER_ONE_WAY]  328.68,103.12 0 top
U$42  AB_7PIN_LOC_CONNECTOR  [AB_7PIN_LOC_CONNECTOR]  24.38,45.47 90 top
U$43  AB_8PIN_LOC_CONNECTOR  [AB_8PIN_LOC_CONNECTOR]  96.77,167.13 180 top
U$44  AB_7805_FLAT  [AB_7805_FLAT]  325.63,165.61 270 top
U$45  AB_5PIN_LOC_CONNECTOR  [AB_5PIN_LOC_CONNECTOR]  139.19,38.86 180 top
U$46  AB_7805_FLAT  [AB_7805_FLAT]  343.41,165.61 270 top
U$47  AB_7805_FLAT  [AB_7805_FLAT]  307.85,165.61 270 top
U$48  AB_7PIN_LOC_CONNECTOR  [AB_7PIN_LOC_CONNECTOR]  128.52,176.02 0 top
U$49  AB_4PIN_LOC_CONNECTOR  [AB_4PIN_LOC_CONNECTOR]  140.72,22.35 180 top
U$50  AB_JUMPER_ONE_WAY  [AB_JUMPER_ONE_WAY]  366.52,122.94 180 top
U$51  AB_JUMPER_ONE_WAY  [AB_JUMPER_ONE_WAY]  366.52,127.51 180 top
U$52  AB_10PIN_LOC_CONNECTOR  [AB_10PIN_LOC_CONNECTOR]  334.77,118.11 90 top
U$53  AB_10PIN_LOC_CONNECTOR  [AB_10PIN_LOC_CONNECTOR]  335.79,139.95 270 top
U$54  AB_PLATED_DRILL_160MIL  [AB_PLATED_DRILL_160MIL]  5.08,5.08 0 top
U$55  AB_PLATED_DRILL_160MIL  [AB_PLATED_DRILL_160MIL]  5.33,184.91 0 top
U$56  AB_PLATED_DRILL_160MIL  [AB_PLATED_DRILL_160MIL]  184.91,5.08 0 top
U$57  AB_PLATED_DRILL_160MIL  [AB_PLATED_DRILL_160MIL]  184.91,184.91 0 top
U$58  AB_PLATED_DRILL_160MIL  [AB_PLATED_DRILL_160MIL]  197.61,184.91 0 top
U$59  AB_PLATED_DRILL_160MIL  [AB_PLATED_DRILL_160MIL]  197.61,5.08 0 top
U$60  AB_PLATED_DRILL_160MIL  [AB_PLATED_DRILL_160MIL]  377.44,184.91 0 top
U$61  AB_PLATED_DRILL_160MIL  [AB_PLATED_DRILL_160MIL]  377.44,5.08 0 top
U$62  AB_JUMPER_ONE_WAY  [AB_JUMPER_ONE_WAY]  164.85,109.22 0 top
U$63  AB_PLATED_DRILL_160MIL  [AB_PLATED_DRILL_160MIL]  338.84,52.83 0 top
U$64  AB_PLATED_DRILL_160MIL  [AB_PLATED_DRILL_160MIL]  264.92,103.38 0 top
ULN_SIG  AB_3PIN_LOC_CONNECTOR  [AB_3PIN_LOC_CONNECTOR]  264.67,91.95 0 top
V-P  AB_RIGHT_TER_BLK_3PIN  [AB_RIGHT_TER_BLK_3PIN]  304.8,5.59 270 top

## Tracks (layer width: path | path; a pad name or v marks a point on that pad's centre or on a via)
5VA  (via drill 0.41, 0.5)
  Top 0.762: NODEMCU.2 v99.57,2.54 | A.1 176.76,10.44 185.34,10.44 187.4,12.5 187.4,99.85 188.24,100.69 188.24,154.23 164.59,177.88 ENA.2 164.59,185.67 163.6,186.67 154.66,186.67 ENB.2 148.34,188.47 101.14,188.47 83.16,170.49 79.7,170.49 | 79.7,170.49 76.43,167.21 76.43,161.44 79.12,158.75 NANO.1 85.37,154.41 87.22,154.41 90.02,151.61 90.02,144.63 v94.26,140.39 | IRH3.P$1 98.04,122.94 IRH2.P$1 102.62,116.08 IRH1.P$1 | U$31.2 12.98,126.72 12.98,178.79 21.11,186.92 63.27,186.92 79.7,170.49
  Bottom 0.762: v99.57,2.54 109.66,2.54 110.68,1.52 165.86,1.52 A.1 | ENB.2 149.81,181.81 139.75,181.81 U$24.VCC | v94.26,140.39 102.62,132.03 IRH3.P$1 | IRH1.P$1 103.3,113.11 105.25,113.11 107.1,111.25 134.62,111.25 R17.P$1 | R17.P$1 137.67,114.3 147.83,114.3 U$2.VIN | R17.P$1 139.39,106.99 139.39,104.34 G_P2.A
5VB  (via drill 0.41)
  Top 1.016: 324.1,78.49 341.12,78.49 344.17,81.53 344.17,98.81 ENA1.1 346.46,103.38 348.74,101.09 349,101.09 | B.1 355.6,23.37 355.6,33.02 350.77,37.85 | RN1.1 331.72,37.85 350.77,37.85 | 350.77,37.85 349,39.62 349,61.6 349,101.09 | 372.11,122.94 373.38,121.67 373.38,112.78 361.7,101.09 349,101.09 | U$50.1 372.11,122.94 | 372.11,122.94 375.67,126.49 375.67,143.26 v370.33,148.59 | CEL2RO.P$1 324.1,78.49 | CEL3RO.P$1 324.1,68.83 324.1,78.49
  Bottom 1.016: ENA1.1 335.79,107.19 318.77,107.19 CEL1RO.P$1 | v370.33,148.59 350.27,168.66 SHARP2.1 SHARP1.1 | SHARP3.1 357.38,185.93 352.81,185.93 SHARP1.1 | U$14.O1 267.72,141.73 267.72,182.12 272.8,187.2 346.46,187.2 SHARP1.1
7VA  (via drill 0.75)
  Top 1.016: U$35.VIN 89.41,132.59 89.41,117.35 v87.12,115.06 | v37.85,115.06 36.07,113.28 ATMEGA_2560.VIN
  Top 1.778: 102.87,17.53 103.89,16.51 NODEMCU.1 107.19,8.38 U$4.VIN | 102.87,17.53 92,17.53 v88.37,13.89 | SERVO3.2 45.21,7.87 43.94,9.14 37.34,9.14 35.56,7.37 | SERVO2.2 16.26,7.87 17.53,9.14 23.88,9.14 25.91,7.11 SERVO4.2 25.91,7.62 27.43,9.14 33.78,9.14 35.56,7.37 | SERVO1.2 35.56,7.37 | v102.11,20.83 102.11,18.29 102.87,17.53
  Bottom 1.016: v87.12,115.06 v37.85,115.06
  Bottom 1.524: SERVO2.2 16.26,3.81 14.73,2.29 13.21,2.29 11.43,4.06 11.43,8.13 2.03,17.53 2.03,47.5 36.07,81.53 U$12.VIN
  Bottom 1.778: v88.37,13.89 77.75,3.28 46,3.28 45.21,4.06 SERVO3.2 | A.2 170.69,26.42 143,54.1 109.47,54.1 102.11,46.74 v102.11,20.83
  Bottom 2.032: ATMEGA_2560.VIN U$12.VIN
7VB  (via drill 1)
  Top 2.032: U$16.O1 240.28,161.04 219.46,140.21 v219.46,137.92 | v217.17,84.84 206.25,73.91 206.25,5.59 v208.03,3.81
  Bottom 2.032: v219.46,137.92 219.46,87.12 v217.17,84.84 | v208.03,3.81 208.28,3.56 356.11,3.56 B.2
+5V
  Top 1.016: IC3.20 342.39,132.33 337.31,127.25 IC3.7 337.31,123.7 339.6,121.41 359.16,121.41 359.28,121.29 | U$50.2 360.93,122.94 359.28,121.29 | JP3.4 359.41,121.16 359.28,121.29
  Bottom 1.016: BAT6.1 313.69,138.94 C5.1 313.75,131.83 CEL2RO1.P$2 320.29,129.03 335.79,129.03 337.31,127.51 IC3.7
-
  Bottom 0.305: ATMEGA_2560.- U$12.-
A0
  Top 0.305: U$12.A0 ATMEGA_2560.A0
  Bottom 0.305: ATMEGA_2560.A0 RFID3.8 44.96,112.27 104.9,112.27 123.44,93.73 163.07,93.73 178.05,78.74 CON2B1.7
A0B
  Top 0.305: LSA_2.4 375.67,171.96 377.95,171.96 378.71,171.2 378.71,168.4 381,166.12 381,84.33 CON2B2.7
A1
  Top 0.305: U$12.A1 43.18,87.88 43.18,99.31 ATMEGA_2560.A1
  Bottom 0.305: ATMEGA_2560.A1 RFID3.7 46.74,111.51 103.72,111.51 123.28,91.95 162.56,91.95 178.31,76.2 CON2B1.8
A1B  (via drill 0.35)
  Top 0.305: v357.89,176.28 v360.93,173.23
  Bottom 0.305: SHARP1.3 355.35,178.82 v357.89,176.28 | CON2B2.8 378.46,79.25 378.46,145.54 360.93,163.07 v360.93,173.23
A2
  Bottom 0.305: U$12.A2 ATMEGA_2560.A2 RFID3.6 48.51,110.74 102.87,110.74 123.44,90.17 162.05,90.17 178.56,73.66 CON2B1.9
A2B
  Bottom 0.305: CON2B2.9 379.73,77.98 379.73,146.56 362.71,163.58 362.71,173.48 361.44,174.75 SHARP2.3
A3
  Bottom 0.305: U$12.A3 ATMEGA_2560.A3 RFID3.5 50.29,109.98 102.11,109.98 123.7,88.39 161.29,88.39 178.56,71.12 CON2B1.10
A3B
  Bottom 0.305: CON2B2.10 380.72,76.43 380.72,148.11 369.57,159.26 369.57,180.09 366.27,183.39 SHARP3.3
A4
  Top 0.305: RFID3.4 52.32,109.47 52.32,149.35 51.56,150.11 RN6.9
  Bottom 0.305: RFID3.4 ATMEGA_2560.A4 OISO4.5 U$12.A4 | RN6.9 50.55,150.37 TR17.3
A5
  Top 0.305: TR18.3 53.59,141.73 53.59,108.71 RFID3.3
  Bottom 0.305: RFID3.3 ATMEGA_2560.A5 OISO4.4 U$12.A5 | TR18.3 51.05,144.27 RN6.7
A6
  Top 0.305: TR19.3 54.86,136.91 54.86,109.98 RFID3.2
  Bottom 0.305: RFID3.2 ATMEGA_2560.A6 OISO4.3 | TR19.3 52.07,138.18 RN6.5
A7  (via drill 0.35)
  Top 0.305: v59.69,120.9 59.69,131.32 58.93,132.08 TR20.3 | v57.91,119.13 57.91,109.47 RFID3.1
  Bottom 0.305: RFID3.1 ATMEGA_2560.A7 OISO4.2 | TR20.3 53.09,132.08 RN6.3 | v59.69,120.9 v57.91,119.13
A8
  Top 0.305: TR21.3 52.32,172.21 52.32,151.89 53.59,150.62 53.59,147.32 54.86,146.05 58.93,146.05 60.63,144.35 60.63,120.98 64.01,117.6 RFID4.8
  Bottom 0.305: TR21.3 54.86,178.82 RN7.9 | RFID4.8 ATMEGA_2560.A8 64.01,88.9 OISO6.1
A9
  Top 0.305: TR22.3 53.59,167.39 53.59,153.67 54.36,152.91 65.53,152.91 67.06,151.38 67.06,108.97 RFID4.7
  Bottom 0.305: RFID4.7 ATMEGA_2560.A9 66.55,88.9 OISO6.2 | TR22.3 53.85,173.74 RN7.7
A10
  Top 0.305: RFID4.6 68.33,109.22 68.33,152.4 66.29,154.43 55.12,154.43 54.86,154.69 54.86,162.56 TR23.3
  Bottom 0.305: RFID4.6 ATMEGA_2560.A10 69.09,88.9 OISO6.3 | TR23.3 55.37,164.59 51.31,168.66 RN7.5
A11
  Top 0.305: TR24.3 57.15,158.75 64.52,158.75 69.6,153.67 69.6,110.49 RFID4.5
  Bottom 0.305: RFID4.5 ATMEGA_2560.A11 71.63,88.9 OISO6.4 | RN7.3 55.12,158.5 TR24.3
A_3V3
  Bottom 0.305: ATMEGA_2560.3V3 U$12.3V3
A_5V  (via drill 0.35, 0.5)
  Top 0.305: U$12.5V1 28.45,87 34.16,81.28 34.16,36.75 35.64,35.28 38.25,35.28 v39.5,34.04 | U$39.+ 50.8,18.29 U$11.5V
  Top 0.762: v90.45,116.43 90.53,116.43 103.07,103.89 U$10.VIN 114.12,103.89 127.25,117.02 127.25,154.69 ENC_PULL.1 | RN6.1 49.66,129.79 v36.3,116.43 33.07,113.21 33.07,107.8 31.09,105.82 29.57,105.82 U$31.1 ATMEGA_2560.5V
  Bottom 0.305: U$11.5V 39.5,29.59 v39.5,34.04
  Bottom 0.508: 70.87,116.69 70.87,120.9 74.93,124.97 74.93,152.15 73.15,153.92 54.61,153.92 RN7.1
  Bottom 0.762: v36.3,116.43 36.55,116.69 70.87,116.69 90.19,116.69 v90.45,116.43
  Bottom 1.016: ATMEGA_2560.5V U$12.5V1
A_5V1
  Top 0.305: U$12.5V 56.64,59.44 56.64,60.07 57.91,61.34 57.91,70.49 ATMEGA_2560.5V3
A_GND1
  Bottom 1.27: ATMEGA_2560.GND U$12.GND2
A_GND2  (via drill 0.35)
  Top 0.305: v59.82,65.79 59.82,76.43 59.31,76.94 ATMEGA_2560.GND5
  Bottom 0.305: v59.82,65.79 58.55,64.52 U$12.GND1
AREF
  Bottom 0.305: ATMEGA_2560.AREF U$12.AREF
B_RX
  Bottom 0.305: SW1.11 69.09,21.95 65.53,18.39 BLUETOOTH.3 63.75,19.05 U$11.RX
B_TX
  Bottom 0.305: SW1.12 71.63,19.91 66.45,14.73 BLUETOOTH.4 63.5,12.7 41.4,12.7 39.37,14.73 39.37,19.81 41.15,21.59 U$11.TX
CS+
  Top 1.016: U$36.1 267.46,57.15 REL3.COM 280.16,57.15 281.69,58.67 281.69,74.42 278.64,77.47 | 278.64,77.47 REL2.COM | 278.64,77.47 281.69,80.52 281.69,94.74 278.64,97.79 REL1.COM
  Top 1.27: CS.1 293.62,12.7 293.62,34.54 287.27,40.89 258.57,40.89 255.78,43.69 255.78,52.83 257.56,54.61 U$36.1
D5  (via drill 0.35)
  Top 0.305: U$12.D5 41.15,38.35 43.43,36.07 56.39,36.07 60.32,40 76.83,40 v80.52,43.69
  Bottom 0.305: ATMEGA_2560.D5 RFID1.6 U$12.D5 | v80.52,43.69 95.76,43.69 108.46,56.39 145.8,56.39 183.39,18.8 185.67,18.8 186.69,19.81 186.69,38.86 CON1A.10
D5B  (via drill 0.35)
  Top 0.305: v315.98,17.78 332.49,17.78 342.14,8.13 370.59,8.13 372.36,9.91 372.36,37.85 CON1B.10
  Bottom 0.305: PPR_R1.P$2 290.32,17.78 v315.98,17.78
D6
  Bottom 0.305: ATMEGA_2560.D6 RFID1.7 U$12.D6 38.1,38.61 38.1,9.65 40.39,7.37 40.39,3.81 38.86,2.29 36.32,2.29 SERVO1.3
D7
  Bottom 0.305: ATMEGA_2560.D7 RFID1.8 U$12.D7
D8
  Bottom 0.305: ATMEGA_2560.D8 U$42.1 U$12.D8
D9
  Bottom 0.305: ATMEGA_2560.D9 U$42.2 U$12.D9
D10
  Bottom 0.305: ATMEGA_2560.D10 U$42.3 U$12.D10
D11  (via drill 0.35)
  Top 0.305: v30.73,7.11 30.73,2.79 32,1.52 38.61,1.52 SERVO3.3
  Bottom 0.305: ATMEGA_2560.D11 U$42.4 U$12.D11 24.38,13.46 v30.73,7.11
D12
  Bottom 0.305: ATMEGA_2560.D12 U$42.5 U$12.D12 21.84,13.72 SERVO2.3
D13  (via drill 0.35)
  Top 0.305: v23.11,34.29 19.3,38.1 U$12.D13
  Bottom 0.305: ATMEGA_2560.D13 U$42.6 U$12.D13 | v23.11,34.29 23.37,34.04 SERVO4.3
D22
  Bottom 0.305: ATMEGA_2560.D22 85.61,52.82 98.54,52.82 JP2.1 103.63,54.1 107.7,58.17 146.3,58.17 CON2A.7
D22B
  Bottom 0.305: CON2B.7 350.67,20.07 346.61,24.13 IC1.4
D23
  Bottom 0.305: ATMEGA_2560.D23 JP2.2 97.79,54.1 99.06,55.37 102.63,55.37 107.2,59.94 147.07,59.94 CON2A.6
D23B
  Bottom 0.305: CON2B.6 375.92,21.59 351.43,21.59 346.35,26.67 IC1.5
D24
  Bottom 0.305: ATMEGA_2560.D24 85.61,55.36 98.03,55.36 99.31,56.64 JP2.3 101.85,56.64 106.93,61.72 147.83,61.72 CON2A.5
D24B
  Bottom 0.305: CON2B.5 375.16,23.37 352.2,23.37 346.35,29.21 IC1.6
D25
  Bottom 0.305: ATMEGA_2560.D25 JP2.4 97.28,56.9 98.3,57.91 101.09,57.91 106.7,63.53 148.56,63.53 CON2A.4
D25B
  Bottom 0.305: CON2B.4 374.65,25.4 352.7,25.4 346.35,31.75 IC1.7
D26
  Top 0.305: JP2.5 113.77,59.18 132.16,77.57 132.16,110.97 142.85,121.67 145.54,121.67 U$2.RS
  Bottom 0.305: JP2.5 98.57,60.44 85.58,60.44 ATMEGA_2560.D26
D27
  Top 0.305: U$2.EN 148.08,124.21 143.46,124.21 130.63,111.38 130.63,78.44 112.65,60.45 98.55,60.45 JP2.6
  Bottom 0.305: JP2.6 ATMEGA_2560.D27
D28
  Top 0.305: JP2.7 111.74,61.72 129.08,79.07 129.08,111.56 151.13,133.6 U$2.D4
  Bottom 0.305: JP2.7 98.54,63 85.61,63 ATMEGA_2560.D28
D29
  Top 0.305: U$2.D5 151.31,136.14 149.02,133.86 149.02,133.38 127.51,111.86 127.51,79.65 110.85,62.99 98.55,62.99 JP2.8
  Bottom 0.305: JP2.8 ATMEGA_2560.D29
D30
  Top 0.305: U$2.D6 150.37,138.68 147.04,135.36 147.04,132.99 125.93,111.89 125.93,80.47 109.73,64.26 JP2.9
  Bottom 0.305: JP2.9 98.54,65.54 85.61,65.54 ATMEGA_2560.D30
D31
  Top 0.305: ATMEGA_2560.D31 95,64.26 96.27,65.53 108.46,65.53 124.46,81.53 124.46,112.27 129.29,117.09 129.29,119.63 150.88,141.22 U$2.D7
  Bottom 0.305: JP2.10 ATMEGA_2560.D31
D32  (via drill 0.35)
  Top 0.305: ATMEGA_2560.D32 85.6,68.07 88.39,68.07 89.15,68.83 89.15,108.97 76.96,121.16 76.96,130.05 R32.P$2 | v90.76,132.25 92.03,132.25 OISO1.5
  Bottom 0.305: ATMEGA_2560.D32 85.6,68.07 98.55,68.07 JP2.11 | R32.P$2 80.26,130.3 88.81,130.3 v90.76,132.25
D33  (via drill 0.35)
  Top 0.305: R18.P$2 78.74,121.41 90.17,109.98 90.17,68.58 88.39,66.8 ATMEGA_2560.D33 | v90.68,127.25 91.19,127.76 OISO1.4
  Bottom 0.305: ATMEGA_2560.D33 JP2.12 | R18.P$2 80.26,127.25 v90.68,127.25
D34  (via drill 0.35)
  Top 0.305: v77.98,71.88 73.41,76.45 73.41,96.98 72.9,97.49 v72.9,118.36 | v85.34,47.75 104.39,47.75 120.9,64.26 v120.9,64.36 | v90.86,119.89 92.64,118.11 95.25,118.11 96.01,118.87 96.01,123.7 94.49,125.22 OISO1.3
  Bottom 0.305: R19.P$2 76.18,149.07 76.18,123.73 72.9,120.46 v72.9,118.36 89.33,118.36 v90.86,119.89 | ATMEGA_2560.D34 80.52,69.34 v77.98,71.88 77.47,71.37 77.47,55.63 v85.34,47.75 | v120.9,64.36 108.11,64.36 103.12,69.34 JP2.13
D35  (via drill 0.35)
  Top 0.305: v75.44,119.63 75.44,81.03 v77.98,78.49 | v90.68,121.92 93.22,121.92 OISO1.2
  Bottom 0.305: JP2.14 ATMEGA_2560.D35 86.36,69.34 85.09,70.61 83.31,70.61 77.98,75.95 v77.98,78.49 | R20.P$2 77.01,146.86 77.01,121.21 v75.44,119.63 88.39,119.63 v90.68,121.92
D36
  Bottom 0.305: ATMEGA_2560.D36 84.84,71.88 86.09,70.63 98.57,70.63 JP2.15 102.87,71.88 109.5,65.25 149.38,65.25 CON2A.3
D36B
  Top 0.305: CON2B.3 381.23,34.52 381.23,68.86 379.48,70.61 373.13,70.61 372.11,71.63 372.11,95 378.21,101.09 378.21,144.78 371.86,151.13 322.07,151.13 R4.P$2
  Bottom 0.305: D1.A 313.94,171.45 313.94,159.26 R4.P$2
D37
  Bottom 0.305: ATMEGA_2560.D37 JP2.16 97.75,71.88 99.02,73.15 104.04,73.15 110.13,67.06 150.11,67.06 CON2A.2
D37B  (via drill 0.35)
  Top 0.305: R10.P$2 338.58,152.4 372.62,152.4 379.22,145.8 379.22,100.58 373.38,94.74 373.38,72.64 v373.89,72.14 | v379.73,68.07 380.24,67.56 380.24,36.07 CON2B.2
  Bottom 0.305: v373.89,72.14 377.95,68.07 v379.73,68.07 | D2.A 331.72,171.7 331.72,159.26 R10.P$2
D38
  Bottom 0.305: ATMEGA_2560.D38 85.6,73.15 98.15,73.15 99.42,74.42 JP2.17 105,74.42 110.46,68.96 150.95,68.96 184.4,35.51 CON2A.1
D38B
  Top 0.305: CON2B.1 379.22,37.59 379.22,65.79 375.41,69.6 372.87,69.6 370.84,71.63 370.84,95.76 376.94,101.85 376.94,144.02 371.09,149.86 305.82,149.86 R11.P$2
  Bottom 0.305: R11.P$2 296.42,159.26 296.42,171.7 D3.A
D39  (via drill 0.35)
  Top 0.305: JP2.18 98.55,75.69 112.01,75.69 120.9,84.58 v120.9,86.87
  Bottom 0.305: JP2.18 ATMEGA_2560.D39 | CON2B1.2 187.2,88.65 187.2,70.36 186.18,69.34 177.8,69.34 160.53,86.61 121.16,86.61 v120.9,86.87
D39B
  Top 0.305: LSA_2.5 379.98,165.1 379.98,96.01 CON2B2.2
D40
  Bottom 0.305: ATMEGA_2560.D40 85.58,75.71 98.57,75.71 JP2.19 104.9,76.96 111.18,70.69 152.03,70.69 179.03,43.69 CON1A.9
D40B  (via drill 0.35)
  Top 0.305: v257.81,34.54 v252.48,39.88
  Bottom 0.305: CON1B.9 353.57,44.96 350.52,41.91 265.18,41.91 v257.81,34.54 | v252.48,39.88 241.55,39.88 239.78,41.66 239.78,47.5 239.27,48.01 228.6,48.01 227.08,46.48 U$6.INA
D41
  Bottom 0.305: ATMEGA_2560.D41 JP2.20 98.04,76.96 99.31,78.23 105.84,78.23 111.81,72.27 153.37,72.27 179.41,46.23 CON1A.8
D41B  (via drill 0.35)
  Top 0.305: v257.81,36.32 v252.48,41.66
  Bottom 0.305: U$6.INB 224.54,47.24 226.82,49.53 240.54,49.53 241.55,48.51 241.55,42.16 242.57,41.15 251.97,41.15 v252.48,41.66 | v257.81,36.32 264.41,42.93 348.74,42.93 353.31,47.5 CON1B.8
D42
  Bottom 0.305: ATMEGA_2560.D42 85.58,78.25 98.31,78.25 99.57,79.5 JP2.21 106.96,79.5 112.24,74.22 154.46,74.22 177.38,51.31 CON1A.6
D42B  (via drill 0.35)
  Top 0.305: CON1B.6 370.84,52.58 368.55,50.29 v368.55,41.4 | v260.35,31.5 258.06,29.21 v253.24,29.21
  Bottom 0.305: v368.55,41.4 367.97,40.82 355.78,40.82 354.08,39.12 267.97,39.12 v260.35,31.5 | v253.24,29.21 224.79,29.21 216.15,37.85 216.15,79.5 219.46,82.8 223.52,82.8 227.08,79.25 U$3.INA
D43  (via drill 0.35)
  Top 0.305: JP2.22 98.55,80.77 110.19,80.77 v110.21,80.8
  Bottom 0.305: JP2.22 ATMEGA_2560.D43 | v110.21,80.8 110.82,80.8 113.87,77.75 156.44,77.75 180.34,53.85 CON1A.5
D43B  (via drill 0.35)
  Top 0.305: v252.22,30.99 258.06,30.99 v260.35,33.27 | v367.54,42.42 367.54,50.8 371.86,55.12 CON1B.5
  Bottom 0.305: U$3.INB 224.54,79.5 222.76,81.28 220.22,81.28 217.42,78.49 217.42,38.61 225.04,30.99 v252.22,30.99 | v260.35,33.27 266.95,39.88 353.31,39.88 355.35,41.91 367.03,41.91 v367.54,42.42
D44
  Bottom 0.305: ATMEGA_2560.D44 85.6,83.31 97.92,83.31 99.19,82.04 JP2.23 100.15,81.71 112.29,81.71 114.55,79.45 157.3,79.45 180.36,56.39 CON1A.4
D44B  (via drill 0.35)
  Top 0.305: v252.98,32.51 257.81,32.51 v260.35,35.05 | v366.52,43.43 366.52,51.56 372.62,57.66 CON1B.4
  Bottom 0.305: U$3.PWM 218.69,74.68 218.69,39.12 225.3,32.51 v252.98,32.51 | v260.35,35.05 266.19,40.89 352.04,40.89 354.23,43.08 366.17,43.08 v366.52,43.43
D45  (via drill 0.35)
  Top 0.305: CON1A.7 180.54,52.63 v180.19,52.63
  Bottom 0.305: ATMEGA_2560.D45 JP2.24 98.55,80.77 108.43,80.77 113.16,76.05 155.4,76.05 178.82,52.63 v180.19,52.63
D45B  (via drill 0.35)
  Top 0.305: v257.81,38.1 v252.48,43.43
  Bottom 0.305: U$6.PWM 222,48.01 225.04,51.05 241.3,51.05 243.08,49.28 243.08,42.93 243.59,42.42 251.46,42.42 v252.48,43.43 | v257.81,38.1 263.65,43.94 347.22,43.94 353.31,50.04 CON1B.7
D46
  Bottom 0.305: ATMEGA_2560.D46 84.84,84.58 86.11,85.85 98.55,85.85 JP2.25 114.05,84.58 115.47,83.16 159.06,83.16 182.02,60.2 185.17,60.2 185.9,60.94 185.9,62.51 CON1A.1
D46B  (via drill 0.35)
  Top 0.305: v265.94,25.15 262.38,21.59 v261.87,21.59
  Bottom 0.305: U$9.PWM 227.33,6.1 249.43,6.1 261.87,18.54 v261.87,21.59 | v265.94,25.15 274.57,33.78 332.49,33.78 334.77,36.07 373.89,36.07 375.16,37.34 379.73,37.34 381.23,38.84 381.23,64.03 379.98,65.28 CON1B.1
D47
  Bottom 0.305: ATMEGA_2560.D47 JP2.26 97.79,84.58 99.06,83.31 100.94,83.31 101.45,82.8 113.69,82.8 115.09,81.41 158.22,81.41 180.7,58.93 CON1A.3
D47B  (via drill 0.35)
  Top 0.305: v260.86,22.61 260.6,22.35 259.59,22.35 257.81,24.13 257.81,25.15 261.37,28.7 262.64,28.7 v263.4,27.94
  Bottom 0.305: U$9.INB 228.85,7.11 248.67,7.11 260.86,19.3 v260.86,22.61 | v263.4,27.94 264.41,27.94 272.29,35.81 330.96,35.81 333.25,38.1 372.87,38.1 374.14,39.37 378.21,39.37 379.22,40.39 379.22,57.91 CON1B.3
D48  (via drill 0.35)
  Top 0.305: v88.01,103.5 88.01,100.97 82.68,95.63 82.68,88.65 84.2,87.12 ATMEGA_2560.D48 | v92.07,103.5 99.82,95.76 JP2.27
  Bottom 0.305: JP2.27 100.08,87.38 114.55,87.38 117.12,84.81 160,84.81 183.34,61.47 CON1A.2 | v92.07,103.5 v88.01,103.5
D48B  (via drill 0.35)
  Top 0.305: v259.84,23.62 262.64,26.42 v264.67,26.42
  Bottom 0.305: U$9.INA 229.87,8.64 248.67,8.64 259.84,19.81 v259.84,23.62 | CON1B.2 380.24,59.44 380.24,39.37 379.22,38.35 374.65,38.35 373.38,37.08 334.01,37.08 331.72,34.8 273.05,34.8 v264.67,26.42
D49  (via drill 0.35)
  Top 0.305: U$39.- 86.61,16 87.63,17.02 87.63,37.32 82.54,42.41 v81.78,42.41
  Bottom 0.305: JP2.28 ATMEGA_2560.D49 86.36,87.12 85.09,85.85 77.98,85.85 76.45,84.33 76.45,54.61 78.49,52.58 78.49,43.94 80.02,42.41 v81.78,42.41
D_GND  (via drill 0.35)
  Top 0.305: U$62.2 166.88,112.52 v167.39,113.03 | ATMEGA_2560.GND2 9.65,58.67 v9.65,68.58 | U$42.7 16.76,89.64 18.66,91.53 36.56,91.53 37.99,90.1 37.99,86.14 45.89,78.24 59.05,78.24 60.65,76.64 60.65,70.41 v66.29,64.77
  Top 0.508: 39.24,140.84 38.61,141.48 38.61,142.55 39.45,143.38 IC9.15 45.34,143.38 v47.24,145.29 | 39.24,140.84 IC9.13 | 39.24,140.84 38.68,140.28 38.68,139.29 39.67,138.3 | 39.67,138.3 38.76,137.39 38.76,136.35 39.34,135.76 IC9.9 43.31,135.76 v45.34,133.73 45.97,133.1 45.97,128.27 34.54,116.84 v33.02,116.84 | IC10.15 39.73,169.04 39.12,168.43 39.12,167.06 39.67,166.5 | 39.67,166.5 IC10.13 | 39.67,166.5 38.89,165.71 38.89,164.47 39.39,163.96 | 39.39,163.96 IC10.11 | 39.39,163.96 38.91,163.47 38.91,162.51 40,161.42 IC10.9 v45.69,161.42 48.01,159.11 v48.01,149.61 | 84.2,142.11 83.51,142.8 83.51,143.82 84.35,144.65 IC8.8 86.21,145.69 v84.07,147.83 | IC8.6 84.2,142.11 | 84.2,142.11 83.39,141.3 83.39,140 83.82,139.57 | 83.82,139.57 IC8.4 91.82,139.57 v92.71,138.68 | 83.82,139.57 83.44,139.19 83.44,137.64 84.05,137.03 | IC8.2 84.05,137.03 | v131.83,167.13 v131.83,155.96 141.73,155.96 U$2.L- | CON2B1.1 181.61,91.19 181.61,84.84 v181.1,84.33 | U$4.GND2 135.64,28.7 136.4,29.46 136.4,44.45 166.88,74.93 v166.88,99.06 | U$4.GND2 137.41,25.15 137.41,16 141.99,11.43 v145.29,11.43 | v123.19,109.73 122.43,108.97 122.43,100.08 121.16,98.81 U$10.GND | v20.32,28.96 25.15,24.13 U$11.GND 43.18,24.13 47.75,19.56 SERVO3.1 | v42.42,7.37 39.88,7.37 SERVO1.1 35.81,3.3 v33.53,3.3 | SERVO2.1 21.84,2.54 25.4,2.54 SERVO4.1 | v25.91,123.44 25.91,126.75 25.65,127 | v44.96,138.43 44.83,138.3 IC9.11 39.67,138.3 | 84.05,137.03 83.95,137.03 80.77,133.86 77.98,133.86 72.14,128.02 v70.87,128.02 | TR20.1 56.13,122.43 v59.94,118.62 61.47,117.09 OISO4.1 66.8,94.23 71.88,89.15 OISO6.5 | ATMEGA_2560.GND2 16.76,81.53 14.48,83.82 14.48,109.22 v21.34,116.08
  Top 0.508: v108.71,143 110.74,140.97 114.55,140.97 116.33,142.75 v116.33,154.94 | G_P2.E 136.4,105.66 140.46,101.6 143.26,101.6 149.86,108.2 U$2.GND | U$4.GND2 132.08,26.92 v127.25,26.92 | v126.24,23.37 115.32,23.37 v113.54,25.15 | v126.24,23.37 126.24,7.11 v122.94,3.81 | v126.24,23.37 126.24,11.5 v125.73,11 | v107.7,45.47 106.73,44.5 106.73,43.4 101.94,38.61 v95,38.61
  Top 0.762: U$17.1 25.65,126.75 25.65,127
  Top 1.27: v166.88,99.06 U$62.2
  Bottom 0.508: v45.69,161.42 45.69,178.21 48.59,181.1 59.33,181.1 61.34,179.1 61.34,175.21 59.31,173.18 | 59.31,173.18 59.18,173.05 58.09,173.05 TR21.1 | 59.31,173.18 61.19,171.3 61.19,168.96 59.54,167.31 59.28,167.31 | 59.28,167.31 57.73,167.31 TR22.1 | 59.28,167.31 61.54,165.05 61.54,162.54 59.79,160.78 | 59.79,160.78 58.17,160.78 TR23.1 | 59.79,160.78 61.57,159 61.57,156.24 60.3,154.97 57.89,154.97 TR24.1 | TR17.1 57.28,147.83 59.61,145.49 59.61,141.66 58.6,140.64 | 58.6,140.64 57.23,140.64 TR18.1 55.63,141.22 47.75,141.22 v44.96,138.43 | 58.6,140.64 59.64,139.6 59.64,135.64 59.16,135.15 | 59.16,135.15 56.62,135.15 TR19.1 | 59.16,135.15 59.64,134.67 59.64,129.44 58.01,127.81 56.64,127.81 56.13,128.32 TR20.1 54.1,127.51 46.23,127.51 45.21,128.52 45.21,133.6 v45.34,133.73 | v131.83,155.96 128.02,152.15 123.7,152.15 U$35.GND1 117.09,155.7 v116.33,154.94 | v131.83,167.13 131.83,180.59 U$24.GND | U$24.GND 136.91,185.67 148.59,185.67 ENB.1 | ENB.1 151.44,185.98 160.48,185.98 ENA.1 | U$2.GND 153.16,108.2 155.45,110.49 | 155.45,110.49 155.45,116.08 153.16,118.36 | U$2.R/W 153.16,118.36 | 153.16,118.36 155.45,120.65 155.45,142.24 U$2.L- | v181.1,84.33 166.88,98.55 v166.88,99.06 155.45,110.49 | v145.29,11.43 151.13,11.43 153.92,8.64 RFID.3 | G_P2.E 136.4,106.68 133.35,109.73 v123.19,109.73 | ATMEGA_2560.GND2 U$42.7 U$12.GND 16.76,32.51 v20.32,28.96 | v42.42,7.37 42.67,7.62 46.23,7.62 47.75,6.1 SERVO3.1 | SERVO4.1 30.73,3.3 v33.53,3.3 | v33.02,116.84 32.51,116.84 v25.91,123.44 21.34,118.87 v21.34,116.08 | v70.87,128.02 61.47,118.62 v59.94,118.62 | v47.24,145.29 47.5,145.54 47.5,149.1 v48.01,149.61
  Bottom 0.508: v84.07,147.83 84.07,149.35 84.84,150.11 88.14,150.11 91.69,153.67 91.69,155.45 92.2,155.96 96.52,155.96 97.79,154.69 97.79,147.57 99.57,145.8 106.68,145.8 108.71,143.76 v108.71,143 | OISO1.1 96.01,122.17 96.01,135.38 v92.71,138.68 | ENB.1 144.24,184.4 143.33,185.31 137.08,185.31 136.25,184.48 136.25,183.31 138.76,180.8 140.51,180.8 v141.73,179.58 | U$24.GND 135.13,171.7 v139.7,167.13 | v127.25,26.92 126.24,25.91 v126.24,23.37 | v113.54,25.15 115.06,26.67 115.06,50.8 113.79,52.07 110.74,52.07 107.7,49.02 v107.7,45.47 | v95,38.61 95,34.54 v91.19,30.73
  other vias: 94.06,45.67 93.88,40.51 94.36,49.3 96.82,97.31 91.26,172.36 172.54,182.37 174.09,18.8 5.44,23.42 146.63,126.34 96.82,144.58 55.91,30.2 31.04,34.47
  pour Top: -0.23,184.68 -0.23,5.08 arc90 4.88,-0.03 184.96,-0.03 arc90 188.59,3.61 188.59,186.72 arc90 185.34,189.97 5.05,189.97 arc90
  pour Bottom: 0,5.08 0,4.83 arc90 4.83,0 184.91,0 arc90 188.72,3.81 188.72,185.17 arc90 183.64,190.25 4.57,190.25 arc90 0.25,185.93 0.25,5.33 arc-90
  pour Top: 128.52,183.9 128.52,175.01 130.05,173.48 146.3,157.23 161.29,157.23 187.45,157.23 188.21,157.99 188.21,186.44 186.44,188.21 132.84,188.21
D_GNDB  (via drill 0.35)
  Top 1.016: C_GND.1 363.22,96.01 v364.49,97.28
  Bottom 1.016: v364.49,97.28 365.51,98.3 373.63,98.3 CON2B2.1
  pour Top: 347.22,111.25 347.22,49.53 360.17,46.99 380.24,46.99 380.75,47.5 380.75,110.49 380.49,110.74 347.73,110.74
GND  (via drill 0.35, 0.6)
  Top 0.508: v270.76,156.97 266.95,153.16 U$38.1 | U$38.1 262.57,153.23 C4.1 256.93,151.59 U$13.OUT- | U$38.1 262.64,147.27 U$8.OUT- 271.84,136.61 C3.1 271.78,132.02 U$37.1 255.52,111.76 U$34.1 241.87,111.76 C1.1 236.82,111.82 U$7.OUT- 236.47,113.94 217.58,132.84 v217.42,132.84 | v217.42,132.84 217.42,132.87 U$13.IN- 195.33,154.97 195.33,162.31 194.31,163.32 194.31,176.53 U$33.2 | v202.18,15.49 202.18,22.61 U$9.IN- 201.17,30.73 201.17,56.9 U$6.IN- 201.17,64.01 201.17,90.17 U$3.IN- 198.63,93.73 204.72,99.82 204.72,104.29 U$7.IN- 217.42,132.74 v217.42,132.84 | v234.7,25.65 U$6.GND v234.7,53.59 236.22,52.07 247.9,52.07 255.52,59.69 U$36.2 262.13,62.48 262.13,75.95 BAT1.2 272.54,86.36 278.13,86.36 280.42,84.07 v280.42,82.3 | v293.12,81.79 295.4,84.07 U$26.1 300.23,86.11 R6.P$1 303.53,79.25 305.05,77.72 306.83,77.72 307.42,77.14 U$19.VSS 307.42,74.75 v306.83,74.17 | CEL1RC.P$1 313.44,98.81 313.44,94.49 311.4,92.46 308.1,92.46 v307.34,93.22 307.42,93.29 U$18.VSS 307.42,97.71 307.34,97.79 299.21,97.79 U$23.1 | R5.P$1 303.53,58.67 304.8,57.4 306.83,57.4 307.42,56.82 U$20.VSS | v330.96,74.42 330.96,69.09 BALANCE1.1 | BALANCE1.1 321.56,59.69 318.52,59.69 315.72,62.48 CEL3RC.P$1 | BALANCE1.1 R34.P$1 | v356.87,34.29 353.06,38.1 353.06,72.9 v354.58,74.42 350.52,78.49 350.52,87.63 375.16,112.27 v375.16,122.68 | IC1.8 349.5,34.29 351.03,32.77 351.03,11.94 v348.23,9.14 | U$29.2 273.56,18.8 268.73,13.97 v268.73,9.14 | v285.5,5.59 287.02,7.11 CS.2 | v367.28,153.92 369.57,156.21 v376.17,156.21 | SHARP1.2 354.84,181.36 360.43,181.36 SHARP3.2 | SHARP2.2 352.81,173.23 348.49,168.91 344.42,168.91 342.65,170.69 U$46.2
  Top 0.508: D2.K 335.28,169.93 333.5,168.15 326.9,168.15 324.87,170.18 U$44.2 | U$47.2 307.09,171.2 | D1.K 317.5,172.21 314.71,169.42 308.86,169.42 307.09,171.2 | U$8.IN- 282.4,167.13 303.02,167.13 307.09,171.2 | U$51.1 369.06,127.76 v373.38,127.76
  Top 1.016: C_GND.2 354.58,82.04 v354.58,74.42 | v346.76,73.89 346.79,73.86 346.79,70.43 R38.P$1
  Bottom 0.305: R38.P$1 360.17,65.79 376.68,82.3 CON2B2.6